# Altium schematic sheet Sheet1.SchDoc
size A; SheetNumber: 1; SheetTotal: 1
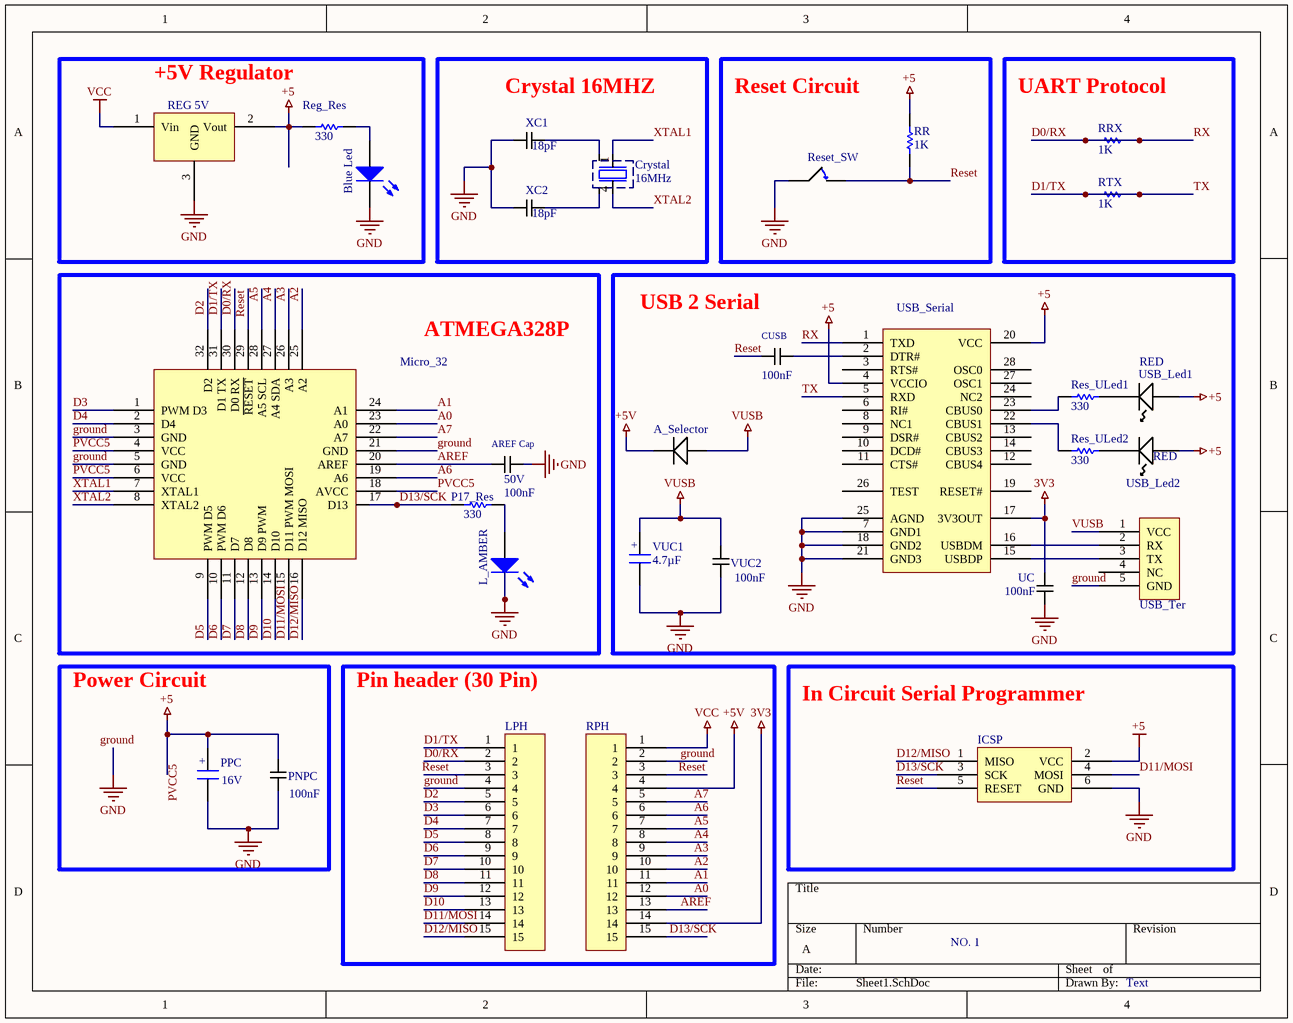
[diagram p0: Sheet1.SchDoc]

## Parts
A_Selector  Panasonic DB2J20900L Schottky Diode, 0.5A, 20V, 2.4ns, 2-Pin SMini2 F5 B  [DIOM1712X07N]  (value not drawn)
AREF_Cap  Voltage: 50V  Capacitance: 100nF  [CAPCP2012X09N]  (hidden comment: 100nF Ceramic Multilayer Capacitor_1)
Blue_Led  Light-Emitting Diode  (value not drawn)
Crystal  value 16MHz  [Aker S5C Crystal]  (hidden comment: Aker 16MHz Crystal SMT)
CUSB  Capacitance: 100nF  [CAPCP2012X09N]  (hidden comment: 100nF Ceramic Multilayer Capacitor_1)
ICSP  Programming Headers Dual Row  [ISP HEADER]  (value not drawn)
L_AMBER  Light-Emitting Diode  (value not drawn)
LPH  connector;str header;single row;.1 cont centers;.095 tail;gold or gtx;36 contact  [Header]  (value not drawn)
Micro_32  (no value)  [TQFP80P900X900X120-32N]
P17_Res  value 330  (hidden comment: Resistor)
PNPC  Capacitance: 100nF  [CAPCP2012X09N]  (hidden comment: 100nF Ceramic Multilayer Capacitor_1)
PPC  Voltage: 16V  [CASE A - 3216X18]  (hidden comment: Capacitor SMT Tantalum)
REG_5V  (no value)  [SOT230P700X180-4N]
Reg_Res  value 330  (hidden comment: Resistor)
Res_ULed1  value 330  (hidden comment: Resistor)
Res_ULed2  value 330  (hidden comment: Resistor)
Reset_SW  (no value)  [Tactile Switch]
RPH  connector;str header;single row;.1 cont centers;.095 tail;gold or gtx;36 contact  [Header]  (value not drawn)
RR  value 1K  (hidden comment: Resistor)
RRX  value 1K  (hidden comment: Resistor)
RTX  value 1K  (hidden comment: Resistor)
UC  Capacitance: 100nF  [CAPCP2012X09N]  (hidden comment: 100nF Ceramic Multilayer Capacitor_1)
USB_Led1  Color: RED  [LED1913X12NRED]  (hidden comment: Kingbright Red LED, 100 mcd 120 ° 0805)
USB_Led2  Color: RED  [LED1913X12NRED]  (hidden comment: Kingbright Red LED, 100 mcd 120 ° 0805)
USB_Serial  FT232RL, Universal Asynchronous Receiver & Transmitter 3MBd, 28-Pin, SSOP  [SOP65P780X200-28N]  (value not drawn)
USB_Ter  NewMolex Right Angle SMT Female Type B Micro USB Connector, 30 V ac, 1.8A  [MicroUSB]  (value not drawn)
VUC1  value 4.7µF  [CASE A - 3216X18]  (hidden comment: Capacitor SMT Tantalum)
VUC2  Capacitance: 100nF  [CAPCP2012X09N]  (hidden comment: 100nF Ceramic Multilayer Capacitor_1)
XC1  Capacitance: 18pF  [CAPCP2012X09N]  (hidden comment: C0805C180J5GACTU)
XC2  Capacitance: 18pF  [CAPCP2012X09N]  (hidden comment: C0805C180J5GACTU)

## Blocks framed on the sheet
+5V Regulator: Blue_Led REG_5V Reg_Res
Crystal 16MHZ: Crystal XC1 XC2
Reset Circuit: Reset_SW RR
UART Protocol: RRX RTX
ATMEGA328P: AREF_Cap L_AMBER Micro_32 P17_Res
USB 2 Serial: A_Selector CUSB Res_ULed1 Res_ULed2 UC USB_Led1 USB_Led2 USB_Serial USB_Ter VUC1 VUC2
Power Circuit: PNPC PPC
Pin header (30 Pin): LPH RPH
In Circuit Serial Programmer: ICSP

## Nets
3V3: RPH.14 UC.2 USB_Serial.17(3V3OUT)
+5: ICSP.2(VCC) PNPC.2 PPC.1 REG_5V.2(Vout) Reg_Res.1 RR.2 USB_Led1.1(A) USB_Led2.1(A) USB_Serial.4(VCCIO) USB_Serial.20(VCC)
+5V: A_Selector.1 RPH.4
GND: AREF_Cap.2 Blue_Led.2(K) ICSP.6(GND) L_AMBER.2(K) PNPC.1 PPC.2 REG_5V.3(GND) Reset_SW.1 UC.1 USB_Serial.7(GND1) USB_Serial.18(GND2) USB_Serial.21(GND3) USB_Serial.25(AGND) VUC1.2 VUC2.1 XC1.1 XC2.1
VCC: REG_5V.1(Vin) RPH.1
VUSB: A_Selector.2 USB_Ter.1(VCC) VUC1.1 VUC2.2
A0: Micro_32.23(A0) RPH.12
A1: Micro_32.24(A1) RPH.11
A2: Micro_32.25(A2) RPH.10
A3: Micro_32.26(A3) RPH.9
A4: Micro_32.27(A4_SDA) RPH.8
A5: Micro_32.28(A5_SCL) RPH.7
A6: Micro_32.19(A6) RPH.6
A7: Micro_32.22(A7) RPH.5
AREF: AREF_Cap.1 Micro_32.20(AREF) RPH.13
D0/RX: LPH.2 Micro_32.30(D0_RX) RRX.1 RRX.2 USB_Serial.1(TXD)  [also labelled RX]
D1/TX: LPH.1 Micro_32.31(D1_TX) RTX.1 RTX.2 USB_Serial.5(RXD)  [also labelled TX]
D2: LPH.5 Micro_32.32(D2)
D3: LPH.6 Micro_32.1(PWM_D3)
D4: LPH.7 Micro_32.2(D4)
D5: LPH.8 Micro_32.9(PWM_D5)
D6: LPH.9 Micro_32.10(PWM_D6)
D7: LPH.10 Micro_32.11(D7)
D8: LPH.11 Micro_32.12(D8)
D9: LPH.12 Micro_32.13(D9_PWM)
D10: LPH.13 Micro_32.14(D10)
D11/MOSI: ICSP.4(MOSI) LPH.14 Micro_32.15(D11_PWM_MOSI)
D12/MISO: ICSP.1(MISO) LPH.15 Micro_32.16(D12_MISO)
D13/SCK: ICSP.3(SCK) Micro_32.17(D13) P17_Res.1 RPH.15
ground: LPH.4 Micro_32.3(GND) Micro_32.5(GND) Micro_32.21(GND) RPH.2 USB_Ter.5(GND)
PVCC5: Micro_32.4(VCC) Micro_32.6(VCC) Micro_32.18(AVCC)
Reset: CUSB.1 ICSP.5(RESET) LPH.3 Micro_32.29(~{RESET}) Reset_SW.1 RPH.3 RR.1
XTAL1: Crystal.1 Micro_32.7(XTAL1)
XTAL2: Crystal.4 Micro_32.8(XTAL2)
NetBlue_Led_1: Blue_Led.1(A) Reg_Res.2
NetCrystal_2: Crystal.2(Gnd) XC2.2
NetCrystal_3: Crystal.3(Gnd) XC1.2
NetCUSB_2: CUSB.2 USB_Serial.2(DTR#)
NetL_AMBER_1: L_AMBER.1(A) P17_Res.2
NetRes_ULed1_1: Res_ULed1.1 USB_Serial.23(CBUS0)
NetRes_ULed1_2: Res_ULed1.2 USB_Led1.2(K)
NetRes_ULed2_1: Res_ULed2.1 USB_Serial.22(CBUS1)
NetRes_ULed2_2: Res_ULed2.2 USB_Led2.2(K)
NetUSB_Serial_15: USB_Serial.15(USBDP) USB_Ter.3(TX)
NetUSB_Serial_16: USB_Serial.16(USBDM) USB_Ter.2(RX)

Not connected (* = marked no-connect by the designer): USB_Serial 3(RTS#) 6(RI#) 8(NC1) 9(DSR#) 10(DCD#) 11(CTS#) 12(CBUS4) 13(CBUS2) 14(CBUS3) 19(RESET#) 24(NC2) 26(TEST) 27(OSC1) 28(OSC0); USB_Ter 4(NC)

## Notes on the sheet
- NO. 1
- Text
- Labels drawn without touching a wire or pin: ground, PVCC5
- (in symbol 4.7µF Tant RS 496-3545) +

## Library data of the parts
A_Selector = Schottky Diode, 0.5A, 20V, 2.4ns, 2-Pin SMini2 F5 B: Created By: R Kanjee; Date Created: 1 March 2015; Manufacturer: Panasonic; RS Stock No.: 713-2703; Manufacturer Part No.: DB2J20900L; Datasheet: http://docs-europe.electrocomponents.com/webdocs/1398/0900766b813986b3.pdf; Maximum Continuous Forward Current: 0.5A; Peak Reverse Repetitive Voltage: 20V
AREF_Cap = 100nF Ceramic Multilayer Capacitor_1: AVX 0805 Standard 100nF Ceramic Multilayer Capacitor, 50 V dc X7R Dielectric ±10% SMD; Creator: Ritesh Kanjee; Date Created: 18 February 2015; Package: 0805; Manufacturer: AVX; RS Stock No.: 464-6688; Datasheet URL: http://za.rs-online.com/web/p/ceramic-multilayer-capacitors/4646688/
Blue_Led L_AMBER = LED: AF: 1; BV: 0; BV_MAX: 1e99; EG: 1.11; FC: 0.5; IBV: 0.001; IS: 1e-14; MJSW: 0.33; NTUN: 30; TNOM: 27; XTI: 3; SimulationGenericComponent: True; CJO: 0; CJP: 0; CTA: 0; CTP: 0; FCS: 0.5; FV_MAX: 1e99; IKF: 0; IKR: 0; ISR: 1e-14; JSW: 0; JTUN: 0; JTUNSW: 0; KEG: 1; KF: 0; LEVEL: 1; N: 1; NBV: 1; NR: 1; NS: 1; PHP: 1; RS: 0; TCV: 0; TLEV: 0; TLEVC: 0; TM1: 0; TM2: 0; TPB: 0; TPHP: 0; TRS: 0; TRS2: 0; TT: 0; TTT1: 0; TTT2: 0; VJ: 1; XTITUN: 3
Crystal = Aker  C5S-16.000-12-3030-X: Aker S5C SMT Crystal; Load Capacitance: 12pF; Frequency Stability: +/-30ppm; Creator: R Kanjee; Manufacturer: Aker; Manufacturer Part #: C5S-16.000-12-3030-X; Supplier: RS; RS Stock Nr.: 671-9488; HelpURL: http://za.rs-online.com/web/p/crystal-units/6719488/; Package: 3.2x5mm SMD
CUSB PNPC UC VUC2 = 100nF Ceramic Multilayer Capacitor_1: AVX 0805 Standard 100nF Ceramic Multilayer Capacitor, 50 V dc X7R Dielectric ±10% SMD; Voltage: 50V; Creator: Ritesh Kanjee; Date Created: 18 February 2015; Package: 0805; Manufacturer: AVX; RS Stock No.: 464-6688; Datasheet URL: http://za.rs-online.com/web/p/ceramic-multilayer-capacitors/4646688/
ICSP = Programming ISP, Programming Headers Dual Row: Manufacturer: FCI; Manufacturer Part No.: 68000-236HLF; Current Rating: 3Amps Continuous; Created By: R Kanjee; Date Created: 1 March 2015; RS Stock No.: 2509565626
LPH RPH = Single row; PCB headers: Manufacturer: FCI; Manufacturer Part No.: 68000-236HLF; Current Rating: 3Amps Continuous; Created By: R Kanjee; Date Created: 1 March 2015; RS Stock No.: 2509565626
Micro_32 = ATMEGA328P-AU: ATMEGA328P-AU, 8 bit AVR Microcontroller 20MHz 1 kB, 32 kB Flash, 2 kB RAM, I2C 32-Pin TQFP; Company: Lumina Inova; Created By: Ritesh Kanjee; Date Created: 14 February 2015; RS Stock No.: 696-3092; Datasheet URL: http://docs-europe.electrocomponents.com/webdocs/0db4/0900766b80db4deb.pdf
P17_Res Reg_Res Res_ULed1 Res_ULed2 RR RRX RTX = Resistor: TC1: 0; SimulationGenericComponent: True; TC2: 0
PPC = 4.7µF Tant RS 496-3545: Capacitor,tantalum,SMT,16V,4.7uF,10%,A-case; Part Originator: H Theron; Value: 4.7µF; RS Stock Nr.: 496-3545; Tolerance: 10%; Package: 3216-18; Publisher: DPSS; LatestRevisionDate: 28-April-2010; ComponentLink1Description: Supplier Website; ComponentLink1URL: http://za.rs-online.com/web/search/searchBrowseAction.html?method=getProduct&R=4963545; ComponentLink2Description: RS Data sheet; ComponentLink2URL: http://docs-europe.origin.electrocomponents.com/webdocs/04ed/0900766b804ed4cc.pdf
REG_5V = LM1117MP-5.0: LM1117MP-5.0/NOPB, Low Dropout Voltage Regulator, 1.5A, 5 V ±1%, 4-Pin SOT-223; Manufacturer: Texas Instruments; Supply Current: 1.5Amps; Output Voltage: 5V; Maximum Input Voltage: 15V; Date Created: 26 February 2015; Created By: R Kanjee; RS Stock No.: 533-9583; Datasheet URL: http://za.rs-online.com/web/p/low-dropout-voltage-regulators/5339583/
Reset_SW = Tactile Switch SPST- NO 0.05A @24V: Manufacturer: Omron; Manufacturer Part No.: B3F1000; State: Normaly Open; Date Created: 25 February 2015; Creator: R Kanjee; RS Stock No.: 686-6847
USB_Led1 USB_Led2 = Kingbright Red LED, 100 mcd 120 ° 0805: Manufacturer Part No.: KP-2012SRC-PRV; Forward Voltage: 1.85V; Creator: Ritesh Kanjee; Date Created: 18 February 2015; Manufacturer: KingBright; RS Stock No.: 466-3813; Datasheet URL: http://za.rs-online.com/web/p/visible-leds/4663813/
USB_Serial = FT232RL USB to UART, Universal Asynchronous Receiver & Transmitter 3MBd, 28-Pin, SSOP: Manufacturer: FTDI Chip; Creator: R Kanjee; Date Created: 03 March 2015; Manufacturer Part No.: FT232RL; RS Stock No.: 406-580; Pin Count: 28
USB_Ter = Micro USB Connector, 30 V ac, 1.8A: Manufacturer: Molex; Manufacturer Part No.: 105017-0001; Max Voltage: 30V; Creator: R Kanjee; Date Created: 28 February 2015; Datasheet URL: http://za.rs-online.com/web/p/micro-usb-connectors/8486764/; Max Current: 1.8A; RS Stock No: 848-6764
VUC1 = 4.7µF Tant RS 496-3545: Capacitor,tantalum,SMT,16V,4.7uF,10%,A-case; Part Originator: H Theron; RS Stock Nr.: 496-3545; Tolerance: 10%; Package: 3216-18; Publisher: DPSS; LatestRevisionDate: 28-April-2010; ComponentLink1Description: Supplier Website; ComponentLink1URL: http://za.rs-online.com/web/search/searchBrowseAction.html?method=getProduct&R=4963545; ComponentLink2Description: RS Data sheet; ComponentLink2URL: http://docs-europe.origin.electrocomponents.com/webdocs/04ed/0900766b804ed4cc.pdf; Voltage: 16V
XC1 XC2 = 18pF Ceramic Multilayer Capacitor, 50 V dc C0G Dielectric ±5% SMD: Manufacturer: Kemet; Voltage: 50V; Creator: Ritesh Kanjee; Date Created: 18 February 2015; Package: 0805; RS Stock No.: 648-0935; Datasheet URL: http://za.rs-online.com/web/p/ceramic-multilayer-capacitors/6480935/?searchTerm=C0805C180J5GACTU&relevancy-data=636F3D3226696E3D4931384E4B6E6F776E41734D504E266C753D656E266D6D3D6D61746368616C6C7061727469616C26706D3D5E5B5C707B4C7D5C707B4E647D2D2C2F255C2E5D2B2426706F3D313326736E3D592673743D4D414E5F504152545F4E554D4245522677633D424F5448267573743D4330383035433138304A35474143545526